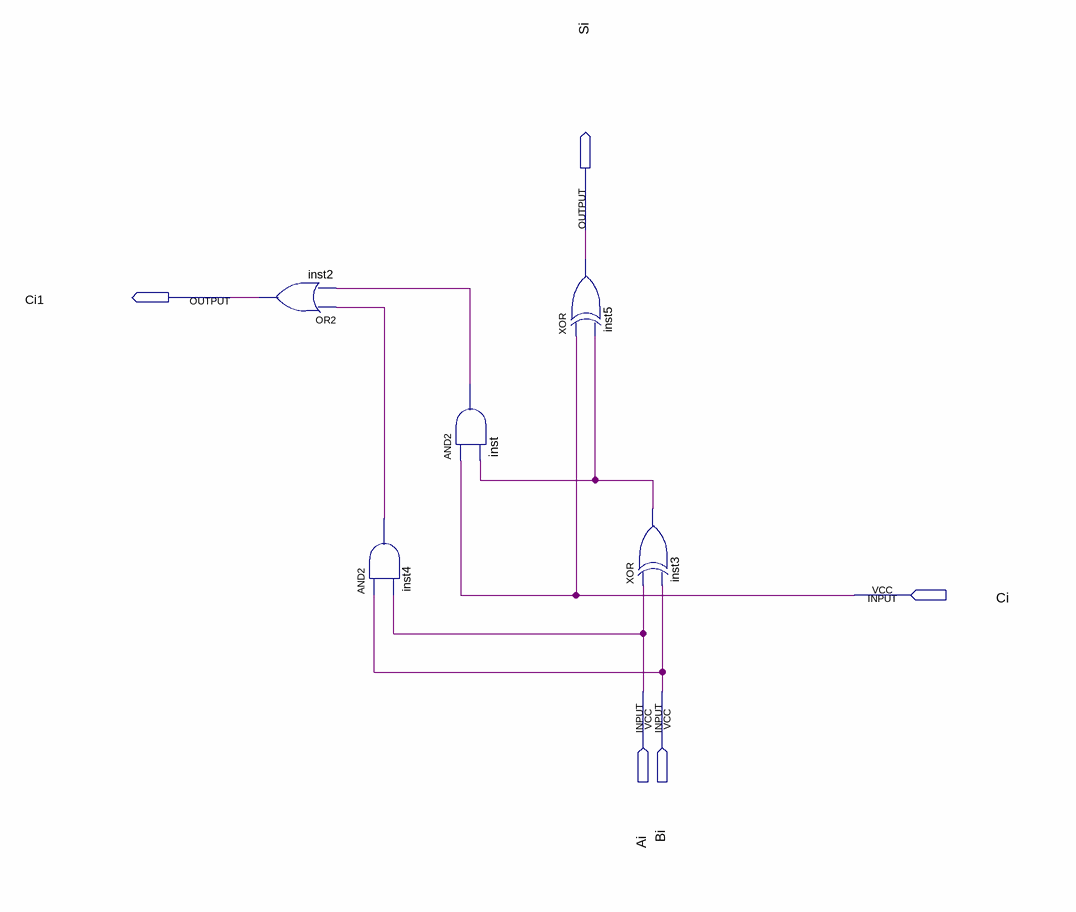
[diagram p0: schematic sheet]
// Quartus schematic MyFA.bdf as structural Verilog: 5 symbols, 5 pins
module MyFA (
  input  Ci,
  input  Ai,
  input  Bi,
  output Si,
  output Ci1
);

  wire inst3_out, inst4_out, inst_out;

  or inst2 (Ci1, inst4_out, inst_out);
  and inst4 (inst4_out, Bi, Ai);
  and inst (inst_out, Ci, inst3_out);
  xor inst5 (Si, Ci, inst3_out);
  xor inst3 (inst3_out, Ai, Bi);
endmodule
